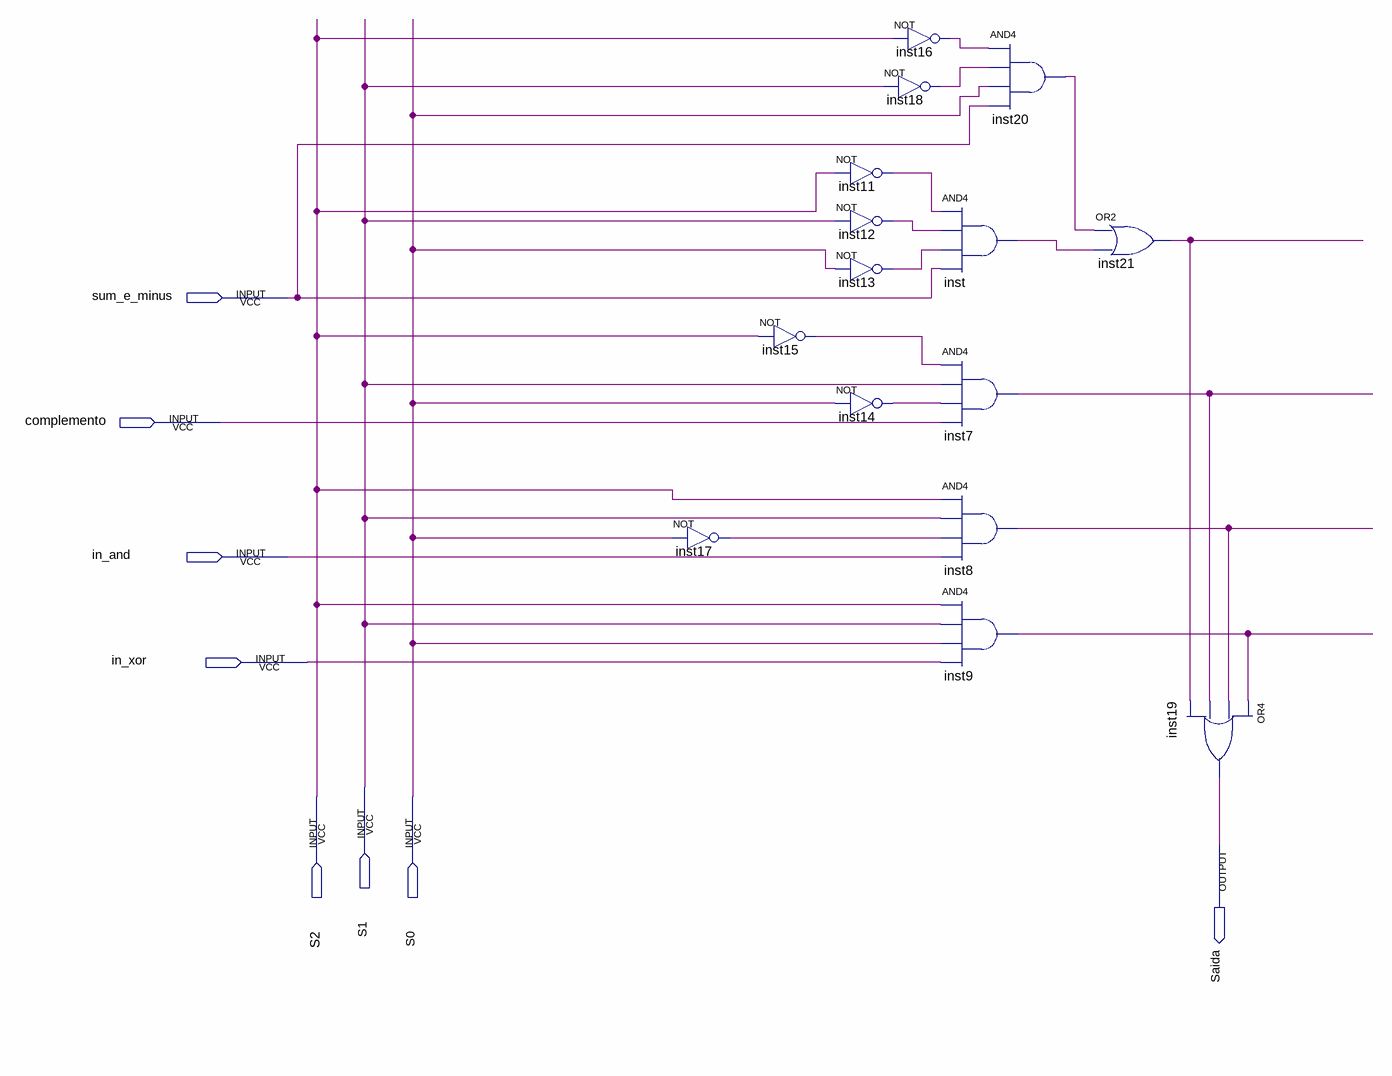
[diagram p0: schematic sheet]
// Quartus schematic miniMUX.bdf as structural Verilog: 15 symbols, 8 pins
module miniMUX (
  input  sum_e_minus,
  input  complemento,
  input  in_and,
  input  in_xor,
  input  S1,
  input  S2,
  input  S0,
  output Saida
);

  wire inst7_out, inst8_out, inst9_out, inst11_out, inst12_out, inst13_out, inst14_out, inst15_out,
       inst16_out, inst17_out, inst18_out, inst20_out, inst21_out, inst_out;

  not inst17 (inst17_out, S0);
  not inst15 (inst15_out, S2);
  not inst16 (inst16_out, S2);
  not inst18 (inst18_out, S1);
  not inst11 (inst11_out, S2);
  not inst12 (inst12_out, S1);
  not inst13 (inst13_out, S0);
  not inst14 (inst14_out, S0);
  and inst (inst_out, inst11_out, inst12_out, inst13_out, sum_e_minus);
  and inst7 (inst7_out, inst15_out, S1, inst14_out, complemento);
  and inst8 (inst8_out, S2, S1, inst17_out, in_and);
  and inst9 (inst9_out, S2, S1, S0, in_xor);
  and inst20 (inst20_out, inst16_out, inst18_out, S0, sum_e_minus);
  or inst21 (inst21_out, inst20_out, inst_out);
  or inst19 (Saida, inst9_out, inst8_out, inst7_out, inst21_out);
endmodule
